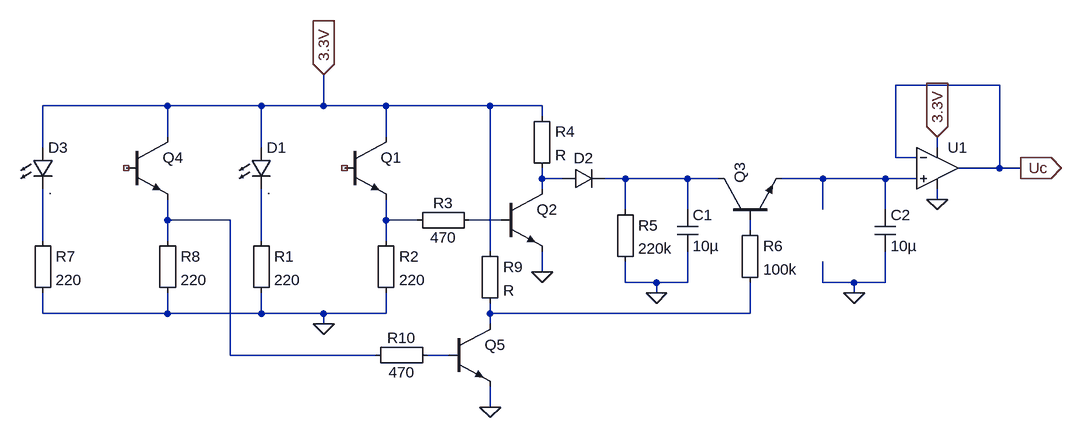
[diagram p0: schematic Lichtschranke_2.asc]
Lichtschranke_2.asc, the LTspice schematic file:
Version 4
SHEET 1 1032 900
WIRE 896 16 736 16
WIRE -384 48 -576 48
WIRE -240 48 -384 48
WIRE -144 48 -144 0
WIRE -144 48 -240 48
WIRE -48 48 -144 48
WIRE 112 48 -48 48
WIRE 192 48 112 48
WIRE 192 64 192 48
WIRE -384 96 -384 48
WIRE -48 96 -48 48
WIRE -576 112 -576 48
WIRE -240 112 -240 48
WIRE 800 112 800 96
WIRE 736 128 736 16
WIRE 768 128 736 128
WIRE 896 144 896 16
WIRE 896 144 832 144
WIRE 928 144 896 144
WIRE 192 160 192 144
WIRE 224 160 192 160
WIRE 320 160 288 160
WIRE 416 160 320 160
WIRE 464 160 416 160
WIRE 624 160 560 160
WIRE 720 160 624 160
WIRE 768 160 720 160
WIRE 192 176 192 160
WIRE 800 192 800 176
WIRE 320 208 320 160
WIRE 416 208 416 160
WIRE 624 208 624 160
WIRE 720 208 720 160
WIRE -384 224 -384 192
WIRE -288 224 -384 224
WIRE -48 224 -48 192
WIRE 0 224 -48 224
WIRE 128 224 80 224
WIRE 512 240 512 224
WIRE -576 256 -576 176
WIRE -384 256 -384 224
WIRE -240 256 -240 176
WIRE -48 256 -48 224
WIRE 112 272 112 48
WIRE 192 304 192 272
WIRE 320 320 320 288
WIRE 368 320 320 320
WIRE 416 320 416 272
WIRE 416 320 368 320
WIRE 624 320 624 288
WIRE 672 320 624 320
WIRE 720 320 720 272
WIRE 720 320 672 320
WIRE 368 336 368 320
WIRE 672 336 672 320
WIRE -576 368 -576 336
WIRE -384 368 -384 336
WIRE -384 368 -576 368
WIRE -240 368 -240 336
WIRE -240 368 -384 368
WIRE -144 368 -240 368
WIRE -48 368 -48 336
WIRE -48 368 -144 368
WIRE 112 368 112 352
WIRE 512 368 512 320
WIRE 512 368 112 368
WIRE -144 384 -144 368
WIRE 112 384 112 368
WIRE -288 432 -288 224
WIRE -64 432 -288 432
WIRE 48 432 16 432
WIRE 112 512 112 480
FLAG -144 0 3.3V
IOPIN -144 0 In
FLAG -144 384 0
FLAG 192 304 0
FLAG 368 336 0
FLAG 800 192 0
FLAG 800 96 3.3V
IOPIN 800 96 In
FLAG 928 144 Uc
IOPIN 928 144 Out
FLAG 672 336 0
FLAG 112 512 0
SYMBOL LED -256 112 R0
SYMATTR InstName D1
SYMATTR Value .
SYMBOL npn -112 96 R0
SYMATTR InstName Q1
SYMATTR Value ""
SYMBOL Misc\\EuropeanResistor -256 240 R0
SYMATTR InstName R1
SYMATTR Value 220
SYMBOL Misc\\EuropeanResistor -64 240 R0
SYMATTR InstName R2
SYMATTR Value 220
SYMBOL Misc\\EuropeanResistor 96 208 R90
WINDOW 0 5 56 VBottom 2
WINDOW 3 27 56 VTop 2
SYMATTR InstName R3
SYMATTR Value 470
SYMBOL npn 128 176 R0
SYMATTR InstName Q2
SYMATTR Value ""
SYMBOL Misc\\EuropeanResistor 176 48 R0
SYMATTR InstName R4
SYMBOL diode 224 176 R270
WINDOW 0 32 32 VTop 2
WINDOW 3 0 32 VBottom 2
SYMATTR InstName D2
SYMATTR Value ""
SYMBOL Misc\\EuropeanResistor 304 192 R0
SYMATTR InstName R5
SYMATTR Value 220k
SYMBOL cap 400 208 R0
SYMATTR InstName C1
SYMATTR Value 10µ
SYMBOL Opamps\\opamp2 800 80 R0
SYMATTR InstName U1
SYMATTR Value ""
SYMBOL cap 704 208 R0
SYMATTR InstName C2
SYMATTR Value 10µ
SYMBOL npn 464 224 R270
SYMATTR InstName Q3
SYMATTR Value ""
SYMBOL Misc\\EuropeanResistor 496 224 R0
SYMATTR InstName R6
SYMATTR Value 100k
SYMBOL LED -592 112 R0
SYMATTR InstName D3
SYMATTR Value .
SYMBOL npn -448 96 R0
SYMATTR InstName Q4
SYMATTR Value ""
SYMBOL Misc\\EuropeanResistor -592 240 R0
SYMATTR InstName R7
SYMATTR Value 220
SYMBOL Misc\\EuropeanResistor -400 240 R0
SYMATTR InstName R8
SYMATTR Value 220
SYMBOL npn 48 384 R0
SYMATTR InstName Q5
SYMATTR Value ""
SYMBOL Misc\\EuropeanResistor 96 256 R0
SYMATTR InstName R9
SYMBOL Misc\\EuropeanResistor 32 416 R90
WINDOW 0 5 56 VBottom 2
WINDOW 3 27 56 VTop 2
SYMATTR InstName R10
SYMATTR Value 470

The netlist it stands for:
* Lichtschranke_2.asc
D1 3.3V N009 .
Q1 3.3V NC_01 N005 0
R1 N009 0 220
R2 N005 0 220
R3 N006 N005 470
Q2 N001 N006 0 0
R4 3.3V N001 R
D2 N001 N002
R5 N002 0 220k
C1 N002 0 10µ
XU1 N003 Uc 3.3V 0 Uc opamp2  ; pins In+ In- V+ V- OUT
C2 N003 0 10µ
Q3 N002 N007 N003 0
R6 N007 N010 100k
D3 3.3V N008 .
Q4 3.3V NC_02 N004 0
R7 N008 0 220
R8 N004 0 220
Q5 N010 N011 0 0
R9 3.3V N010 R
R10 N011 N004 470
.model D D
.lib standard.dio
.model NPN NPN
.model PNP PNP
.lib standard.bjt
.backanno
.end